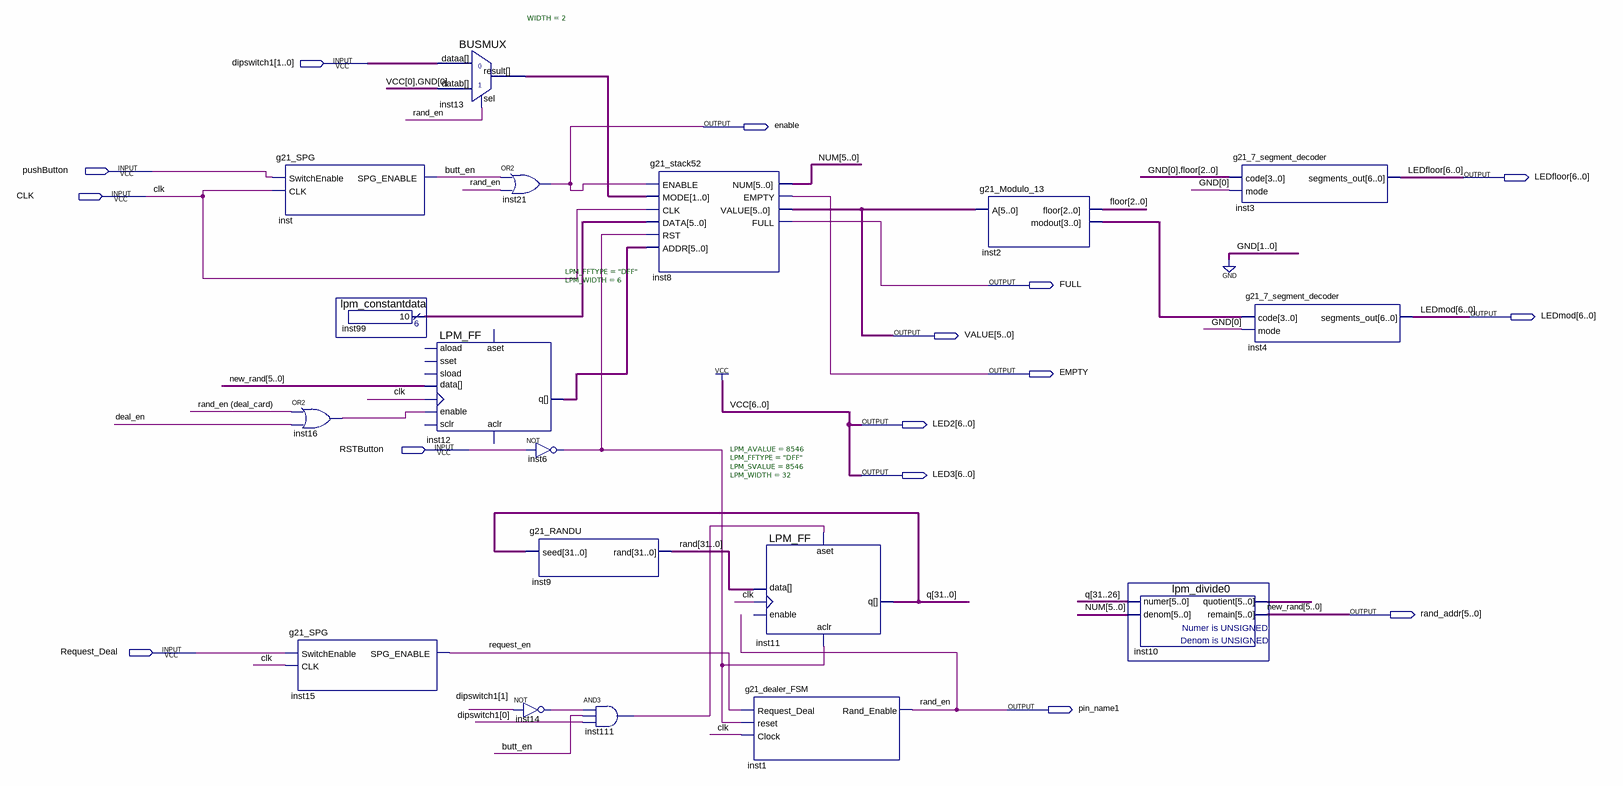
[diagram p0: schematic sheet]
// Quartus schematic g21_test_bed_lab4.bdf as structural Verilog: 18 symbols, 15 pins
module g21_test_bed_lab4 (
  input  [1:0] dipswitch1,
  input  pushButton,
  input  CLK,
  input  RSTButton,
  input  Request_Deal,
  output enable,
  output [6:0] LEDfloor,
  output FULL,
  output [6:0] LEDmod,
  output [5:0] VALUE,
  output EMPTY,
  output [6:0] LED2,
  output [6:0] LED3,
  output [5:0] rand_addr,
  output pin_name1
);

  wire butt_en, deal_en, inst6_out, inst14_out, inst16_out, inst111_out, \rand_en_(deal_card) , request_en;
  wire [1:0] inst13_result;
  wire [2:0] floor;
  wire [3:0] inst2_modout;
  wire [5:0] inst10_quotient, inst12_q, inst99_result, NUM;
  wire [31:0] q, \rand ;

  g21_SPG inst (.SwitchEnable(pushButton), .CLK(CLK), .SPG_ENABLE(butt_en));
  g21_SPG inst15 (.SwitchEnable(Request_Deal), .CLK(CLK), .SPG_ENABLE(request_en));
  lpm_constantdata inst99 (.result(inst99_result));
  or inst16 (inst16_out, \rand_en_(deal_card) , deal_en);
  BUSMUX #(.WIDTH(2)) inst13 (.datab(2'b10), .sel(pin_name1), .dataa(dipswitch1), .result(inst13_result));
  LPM_FF #(.LPM_FFTYPE("DFF"), .LPM_WIDTH(6)) inst12 (
    .enable(inst16_out), .clock(CLK), .data(rand_addr), .q(inst12_q));  // open: aload, sset, sload, aset, sclr, aclr
  or inst21 (enable, butt_en, pin_name1);
  not inst6 (inst6_out, RSTButton);
  g21_RANDU inst9 (.seed(q), .\rand (\rand ));
  not inst14 (inst14_out, dipswitch1[1]);
  and inst111 (inst111_out, inst14_out, butt_en, dipswitch1[0]);
  g21_stack52 inst8 (
    .ENABLE(enable), .MODE(inst13_result), .CLK(CLK), .DATA(inst99_result), .RST(inst6_out), .ADDR(inst12_q),
    .NUM(NUM), .EMPTY(EMPTY), .VALUE(VALUE), .FULL(FULL));
  g21_dealer_FSM inst1 (.Request_Deal(request_en), .reset(inst6_out), .Clock(CLK), .Rand_Enable(pin_name1));
  LPM_FF #(.LPM_AVALUE(8546), .LPM_FFTYPE("DFF"), .LPM_SVALUE(8546), .LPM_WIDTH(32)) inst11 (
    .aclr(inst6_out), .aset(inst111_out), .clock(CLK), .data(\rand ), .q(q));  // open: enable
  g21_Modulo_13 inst2 (.A(VALUE), .floor(floor), .modout(inst2_modout));
  lpm_divide0 inst10 (.numer(q[31:26]), .denom(NUM), .quotient(inst10_quotient), .remain(rand_addr));
  g21_7_segment_decoder inst3 (.code({1'b0, floor}), .mode(1'b0), .segments_out(LEDfloor));
  g21_7_segment_decoder inst4 (.code(inst2_modout), .mode(1'b0), .segments_out(LEDmod));

  assign LED2 = {7{1'b1}};
  assign LED3 = {7{1'b1}};

  // Other names for the same wires on the sheet: new_rand[5:0] = rand_addr; rand_en = pin_name1
endmodule
